# EAGLE design SparkFun_Motor_Driver-TB6612FNG_v11 (EAGLE 7.1.0)
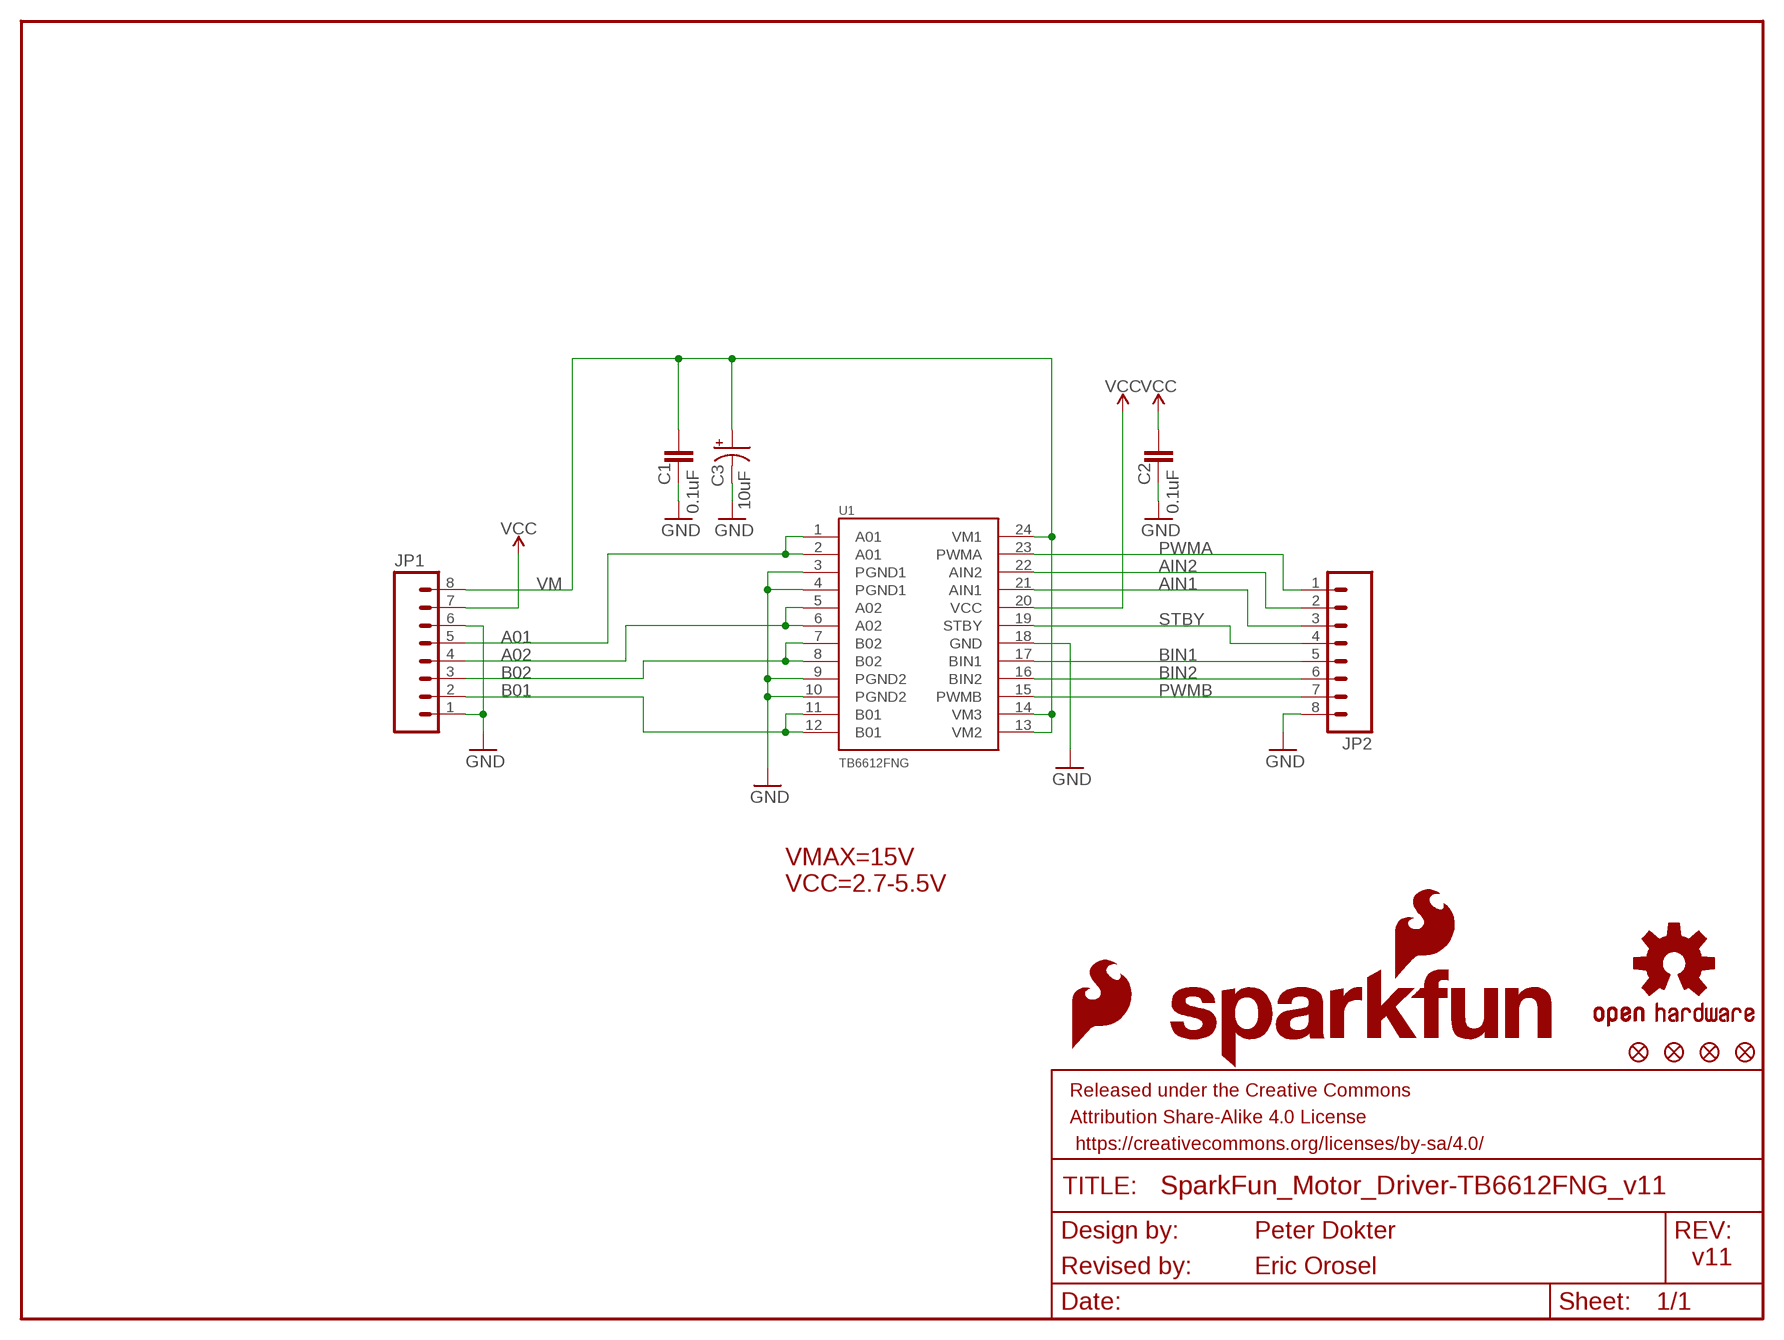
[diagram p0: schematic, sheet 1]

## Parts
C1  0.1uF  0.1UF-0402-16V-10%  [0402]
C2  0.1uF  0.1UF-0402-16V-10%  [0402]
C3  10uF  10UF-POLAR-EIA3528-20V-10%(TANT)  [EIA3528]
FD1  FIDUCIALUFIDUCIAL  [FIDUCIAL-MICRO]
FD2  FIDUCIALUFIDUCIAL  [FIDUCIAL-MICRO]
FD3  FIDUCIALUFIDUCIAL  [FIDUCIAL-MICRO]
FD4  FIDUCIALUFIDUCIAL  [FIDUCIAL-MICRO]
FRAME1  FRAME-LETTER  [CREATIVE_COMMONS]
JP1  M0875_PERCENT_REDUCED  [1X08_OFFSET_REDUCED]
JP2  M0875_PERCENT_REDUCED  [1X08_OFFSET_REDUCED]
LOGO1  SFE_LOGO_FLAME.1_INCH  [SFE_LOGO_FLAME_.1]
LOGO2  OSHW-LOGOS  [OSHW-LOGO-S]
LOGO4  SFE_LOGO_NAME_FLAME.1_INCH  [SFE_LOGO_NAME_FLAME_.1]
U1  TB6612FNG  [SSOP24]

## Nets
A01: JP1.5 U1.1(A01) U1.2(A01)
A02: JP1.4 U1.5(A02) U1.6(A02)
AIN1: JP2.3 U1.21(AIN1)
AIN2: JP2.2 U1.22(AIN2)
B01: JP1.2 U1.11(B01) U1.12(B01)
B02: JP1.3 U1.7(B02) U1.8(B02)
BIN1: JP2.5 U1.17(BIN1)
BIN2: JP2.6 U1.16(BIN2)
GND: C1.2 C2.2 C3.C(-) JP1.1 JP1.6 JP2.8 U1.3(PGND1) U1.4(PGND1) U1.9(PGND2) U1.10(PGND2) U1.18(GND)
PWMA: JP2.1 U1.23(PWMA)
PWMB: JP2.7 U1.15(PWMB)
STBY: JP2.4 U1.19(STBY)
VCC: C2.1 JP1.7 U1.20(VCC)
VM: C1.1 C3.A(+) JP1.8 U1.13(VM2) U1.14(VM3) U1.24(VM1)

## Notes on the sheet
- VMAX=15V
  VCC=2.7-5.5V
- Peter Dokter
- v11
- Revised by: | Eric Orosel

## Library data of the parts
C1 C2 = SparkFun-Capacitors:0.1UF: 0.1µF ceramic capacitors A capacitor is a passive two-terminal electrical component used to store electrical energy temporarily in an electric field.; PROD_ID: CAP-12416
C3 = SparkFun-Capacitors:10UF-POLAR: 10.0µF polarized capacitors A capacitor is a passive two-terminal electrical component used to store electrical energy temporarily in an electric field.; PROD_ID: CAP-08063
FD1-FD4 = SparkFun-Aesthetics:FIDUCIAL: Fiducial Alignment Points Point-of-reference for pick-and-place machines and other optical instruments.
FRAME1 = SparkFun-Aesthetics:FRAME-LETTER: Schematic Frame - Letter Standard 8.5x11 US Letter frame
JP1 JP2 = Testing:M08: Header 8 Standard 8-pin 0.1" header. Use with straight break away headers (SKU : PRT-00116), right angle break away headers (PRT-00553), swiss pins (PRT-00743), machine pins (PRT-00117), and female headers (PRT-00115).
LOGO1 = SparkFun-Aesthetics:SFE_LOGO_FLAME: SparkFun Flame Logo This is the SparkFun flame logo. The logo on the schematic will always be the same size; the package variant is the height of the flame. Default layer for the logo on the board is tSilk.
LOGO2 = SparkFun-Aesthetics:OSHW-LOGO: Open-Source Hardware (OSHW) Logo This logo indicates the piece of hardware it is found on incorporates a OSHW license and/or adheres to the definition of open source hardware found here: http://freedomdefined.org/OSHW
LOGO4 = SparkFun-Aesthetics:SFE_LOGO_NAME_FLAME: SparkFun Font Logo w/ Flame This is the SparkFun full logo. The logo on the schematic will always be the same size; the package variant is the height of the flame part of the logo. Default layer for the logo on the board is tSilk.
U1 = SparkFun-IC-Special-Function:TB6612FNG: Toshiba 1A dual motor driver IC-09363; PROD_ID: IC-09363

## Net classes
1 8_mil: width 0.203 mm
2 10_mil: width 0.254 mm
3 12_mil: width 0.305 mm
4 15_mil: width 0.381 mm
5 20_mil: width 0.508 mm
6 25_mil: width 0.635 mm
7 30_mil: width 0.762 mm

## Board
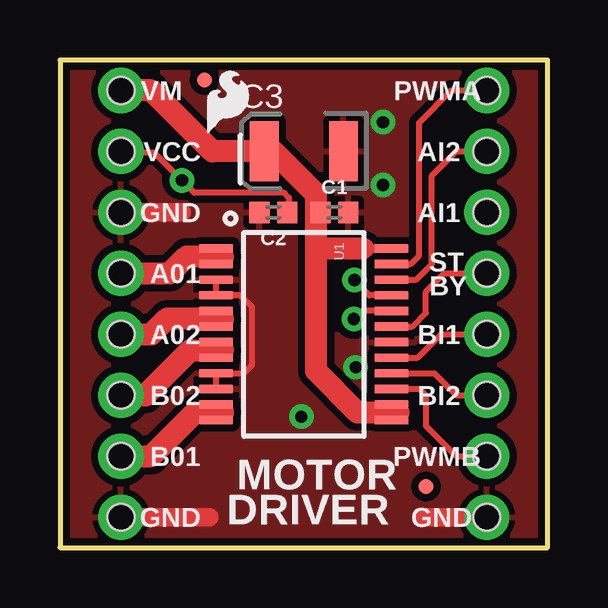
[diagram p1: board, top side]
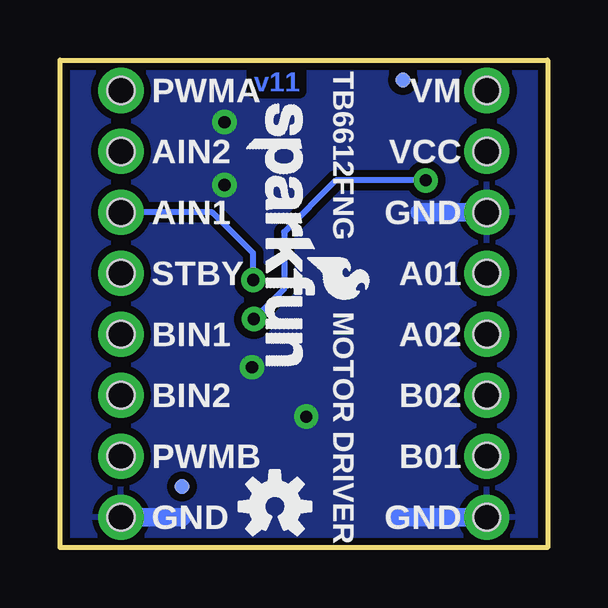
[diagram p2: board, bottom side, seen from below]

Size 20.32 x 20.32 mm. Coordinates in mm from the lower left corner, seen from the top.
Outline: 0,0 20.32,0 20.32,20.32 0,20.32 0,0
Copper layers (1*16): Top 0.035mm / dielectric 1.5mm / Bottom 0.035mm
Design rules "SparkFun-2-layer-STANDARD": minimum track width 10mil, minimum drill 20mil, track to track 10mil, track to pad 8mil, pad to pad 8mil, via to via 10mil, smd to smd 8mil, copper to edge 8mil, drill to drill 8mil, minimum pad ring 10mil, minimum via ring 10mil, stop-mask expansion 4mil, vias tented up to drill 25mil, thermal gap 10mil

### Footprints (pad centres in the part's own frame; a part is rotated, then mirrored left to right if it is on the bottom)
0402 = smd 0.85 x 0.9: 1 -0.58,0; 2 0.58,0
EIA3528 = smd 1.2 x 2.5: A 1.65,0; C -1.65,0
FIDUCIAL-MICRO = smd 0.635 x 0.635: 1 0,0
1X08_OFFSET_REDUCED = drill 1.118 pad 1.88: 1 0,0; 2 2.54,0; 3 5.08,0; 4 7.62,0; 5 10.16,0; 6 12.7,0; 7 15.24,0; 8 17.78,0 | hole 1.118: 0,0; 2.54,0; 5.08,0; 7.62,0; 10.16,0; 12.7,0; 15.24,0; 17.78,0
SSOP24 = smd 0.348 x 1.397: 1 -3.575,-3.656; 2 -2.925,-3.656; 3 -2.275,-3.656; 4 -1.625,-3.656; 5 -0.975,-3.656; 6 -0.325,-3.656; 7 0.325,-3.656; 8 0.975,-3.656; 9 1.625,-3.656; 10 2.275,-3.656; 11 2.925,-3.656; 12 3.575,-3.656; 13 3.575,3.656; 14 2.925,3.656; 15 2.275,3.656; 16 1.625,3.656; 17 0.975,3.656; 18 0.325,3.656; 19 -0.325,3.656; 20 -0.975,3.656; 21 -1.625,3.656; 22 -2.275,3.656; 23 -2.925,3.656; 24 -3.575,3.656

### Placement (x,y rotation side)
C1  11.43,13.97 0 top
C2  8.89,13.97 180 top
C3  10.16,16.51 180 top
FD1  6.02,19.48 0 bottom
FD2  15.24,2.54 0 top
FD3  15.24,2.54 0 bottom
FD4  6.02,19.48 0 top
FRAME1  -19.05,-12.7 0 top  (outside the outline)
JP1  2.54,1.27 90 top
JP2  17.78,19.05 270 top
LOGO1  5.84,16.94 0 top
LOGO2  11.37,1.71 0 bottom
LOGO4  12.64,18.92 270 bottom
U1  10.16,8.89 270 top

### Tracks (layer width: path | path; a pad name or v marks a point on that pad's centre or on a via)
A01
  Top 0.254: U1.1 6.5,12.29 6.35,12.14 6.5,11.99 U1.2
  Top 0.914: 6.78,12.12 6.76,12.14 6.35,12.14 5.28,12.14 4.57,11.43 JP1.5
A02
  Top 0.254: U1.5 6.5,9.7 6.35,9.55 6.5,9.4 U1.6
  Top 0.914: 6.78,9.53 6.76,9.55 6.35,9.55 4.47,9.55 3.81,8.89 JP1.4
AIN1  (via drill 0.51)
  Top 0.254: U1.21 12.9,10.52 v12.27,11.15
  Bottom 0.254: JP2.3 13.97,13.97 12.27,12.27 v12.27,11.15
AIN2
  Top 0.254: U1.22 14.85,11.16 15.49,11.81 15.49,15.49 16.51,16.51 JP2.2
B01
  Top 0.254: U1.12 6.5,5.49 6.35,5.64 6.5,5.79 U1.11
  Top 0.914: 6.78,5.64 6.35,5.64 5.64,5.64 3.81,3.81 JP1.2
B02
  Top 0.254: U1.8 6.5,8.08 6.35,8.23 6.5,8.38 U1.7
  Top 0.914: 6.78,8.23 6.35,8.23 5.44,8.23 3.56,6.35 JP1.3
BIN1
  Top 0.254: U1.17 14.9,7.92 15.88,8.89 JP2.5
BIN2
  Top 0.254: U1.16 15.6,7.26 16.51,6.35 JP2.6
GND  (via drill 0.51)
  Top 0.254: U1.10 U1.9 7.65,7.26 8,7.62 8,10.03 7.52,10.52 U1.4 U1.3
  Top 0.762: JP1.1 6.22,1.27 | JP2.8 15.24,1.27 | JP1.6 5.08,13.97
  Bottom 0.762: JP1.6 5.33,13.97 | JP1.1 6.22,1.27 | JP2.8 15.24,1.27
  other vias: 12.32,7.52 13.46,15.11 10.06,5.46 13.46,17.73
  pour Top (isolate 0.305): 0,0 20.32,0 20.32,20.32 0,20.32
  pour Bottom (isolate 0.305): 0,0 20.32,0 20.32,20.32 0,20.32
PWMA
  Top 0.254: U1.23 14.61,11.81 14.96,12.17 14.96,17.7 16.31,19.05 JP2.1
PWMB
  Top 0.254: U1.15 14.97,6.62 15.24,6.35 15.24,5.08 16.51,3.81 JP2.7
STBY
  Top 0.254: U1.19 14.68,9.21 15.24,9.78 15.24,10.67 16,11.43 JP2.4
VCC  (via drill 0.51)
  Top 0.254: U1.20 12.58,9.87 v12.24,9.53 | JP1.7 2.6,16.45 3.94,16.45 v5.08,15.3 5.6,14.78 9.35,14.78 9.54,14.59 9.54,14.04 C2.1
  Bottom 0.254: v5.08,15.3 8.83,15.3 10.99,13.14 10.99,10.78 v12.24,9.53
VM
  Top 0.254: 10.67,13.97 C1.1 | U1.14 13.82,5.79 13.97,5.64 13.82,5.49 U1.13
  Top 0.343: 12.71,12.46 12.7,12.47
  Top 0.348: U1.24 12.71,12.46
  Top 0.813: 12.57,12.47 12.7,12.47
  Top 0.914: 10.67,12.7 10.67,7.37 12.39,5.64 13.97,5.64 14.1,5.64 | 10.67,12.7 10.67,13.97 10.67,14.73 8.89,16.51 C3.A 6.35,16.51 3.81,19.05 JP1.8 | 12.57,12.47 10.9,12.47 10.67,12.7

### Text on the board
Bottom: v11
tPlace: VM | PWMA | VCC | AI2 | GND | AI1 | A01 | ST | BY | A02 | BI1 | B02 | BI2 | B01 | PWMB | GND | MOTOR | DRIVER | GND
bPlace: VM | TB6612FNG | PWMA | VCC | AIN2 | GND | AIN1 | A01 | STBY | MOTOR DRIVER | A02 | BIN1 | B02 | BIN2 | B01 | PWMB | GND | GND
tDocu: Peter Dokter | Revised by: | Eric Orosel